# EAGLE schematic optocsatolo (EAGLE 6.4)
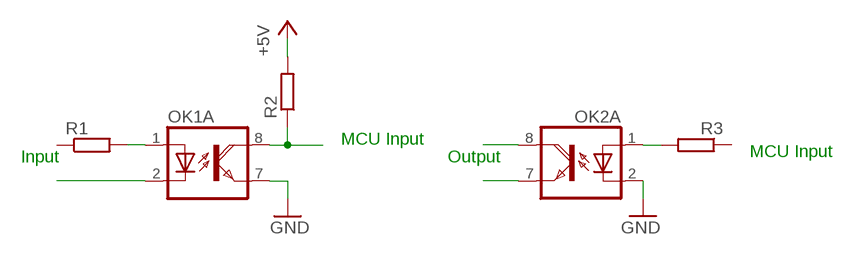
[diagram p0: schematic, sheet 1]

## Parts
OK1  TIL198  [DIL08]
OK2  TIL198  [DIL08]
R1  R-EU_R1206W  [R1206W]
R2  R-EU_R1206W  [R1206W]
R3  R-EU_R1206W  [R1206W]

## Nets
+5V: R2.2
GND: OK1.7(A:EMI) OK2.2(A:C)
N$1: OK1.8(A:COL) R2.1
N$2: OK2.7(A:EMI)
N$3: OK1.1(A:A) R1.2
N$4: OK1.2(A:C)
N$5: OK2.1(A:A) R3.2
N$6: OK2.8(A:COL)
Unconnected: OK1.3(B:A) OK1.4(B:C) OK1.5(B:EMI) OK1.6(B:COL) OK2.3(B:A) OK2.4(B:C) OK2.5(B:EMI) OK2.6(B:COL) R1.1 R3.1

## Notes on the sheet
- MCU Input | MCU Input
- Input | Output

## Library data of the parts
OK1 OK2 = optocoupler:TIL198: TEXAS INSTRUMENTS OPTO COUPLER; OC_FARNELL: unknown; OC_NEWARK: unknown
R1-R3 = resistor:R-EU_: RESISTOR, European symbol